# Altium schematic sheet Kalibracija3.SchDoc
size A4
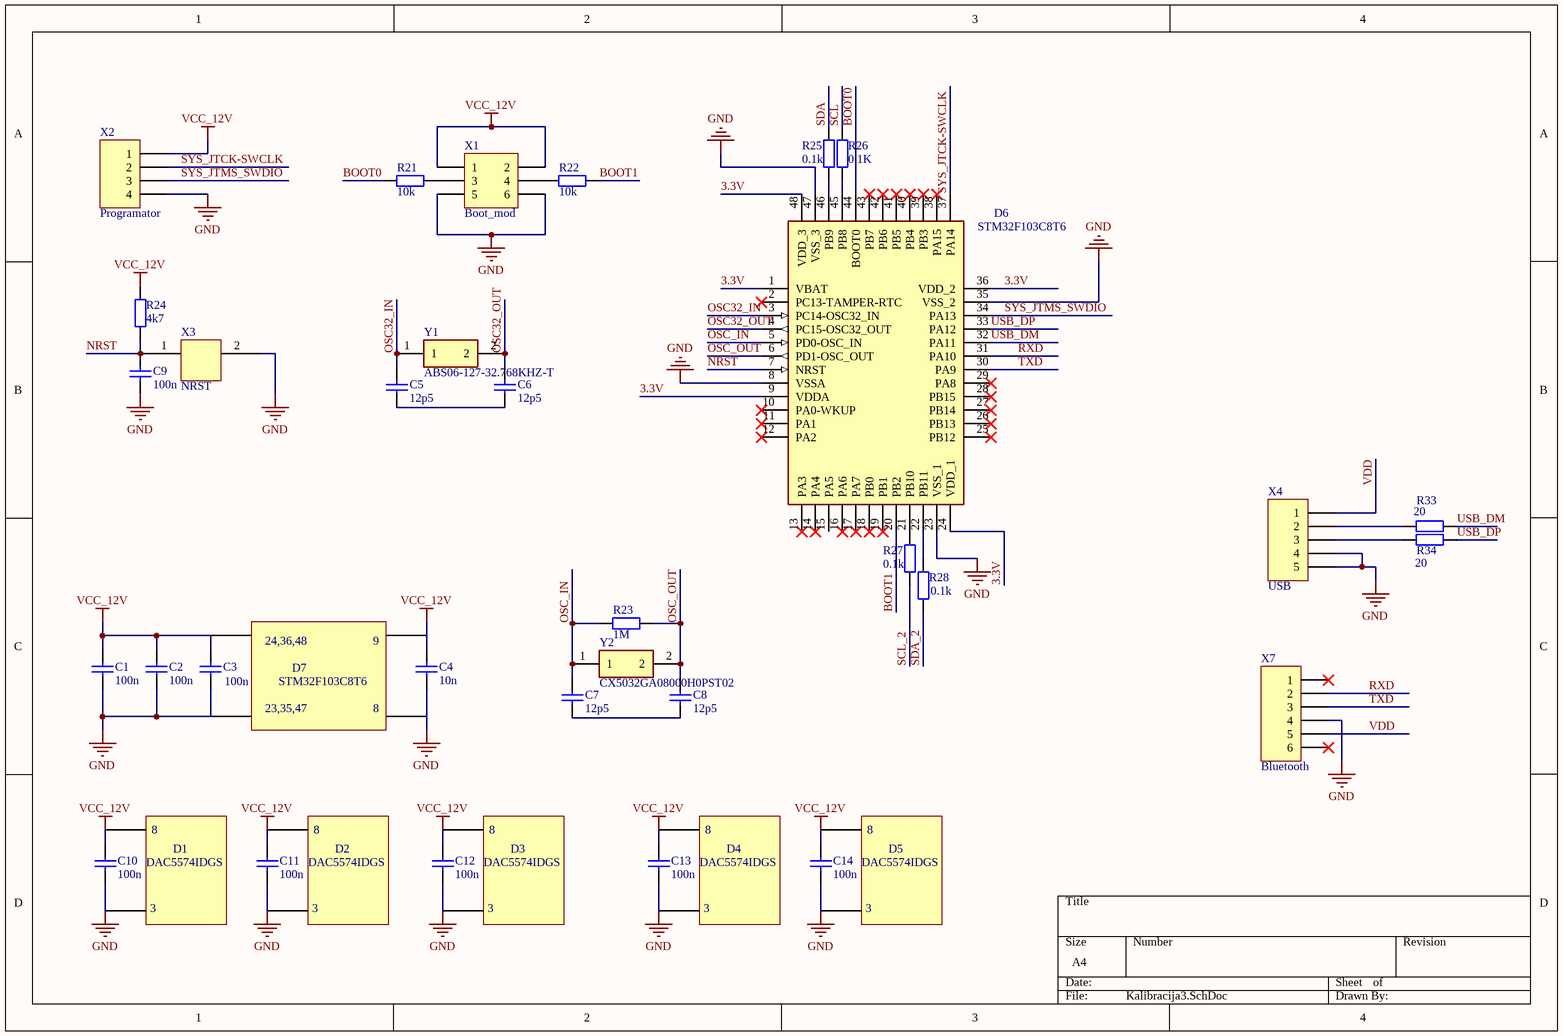
[diagram p0: Kalibracija3.SchDoc]

## Parts
C1  100n  [6-0805_N]
C2  100n  [6-0805_N]
C3  100n  [6-0805_N]
C4  10n  [6-0805_N]
C5  12p5  [6-0805_N]
C6  12p5  [6-0805_N]
C7  12p5  [6-0805_N]
C8  12p5  [6-0805_N]
C9  100n  [6-0805_N]
C10  100n  [6-0805_N]
C11  100n  [6-0805_N]
C12  100n  [6-0805_N]
C13  100n  [6-0805_N]
C14  100n  [6-0805_N]
D6  STM32F103C8T6  [QFP50P900X900X160-48N]
R21  10k  [6-0805_N]
R22  10k  [6-0805_N]
R23  1M  [6-0805_N]
R24  4k7  [6-0805_N]
R25  0.1k  [6-0805_N]
R26  0.1K  [6-0805_N]
R27  0.1k  [6-0805_N]
R28  value 0.1k  [AXIAL-0.4]  (hidden comment: Res2)
R33  20  [6-0805_N]
R34  20  [6-0805_N]
X1  Boot_mod  [HDR2X3]
X2  Programator  [HDR1X4]
X3  NRST  [HDR1X2]
X4  USB  [HDR1X5]
X7  Bluetooth  [HDR1X6]
Y1  ABS06-127-32.768KHZ-T  [ABS0612732768KHZT]
Y2  CX5032GA08000H0PST02  [CX5032GA08000H0PST02]

## Nets
GND: C1.1 C2.1 C3.1 C4.1 C9.1 C10.1 C11.1 C12.1 C13.1 C14.1 D6.8(VSSA) D6.23(VSS_1) D6.35(VSS_2) D6.47(VSS_3) X1.5 X1.6 X2.4 X3.2 X4.4 X4.5 X7.4
VCC_12V: C1.2 C2.2 C3.2 C4.2 C10.2 C11.2 C12.2 C13.2 C14.2 R24.1 X1.1 X1.2 X2.1
3.3V: D6.1(VBAT) D6.9(VDDA) D6.24(VDD_1) D6.36(VDD_2) D6.48(VDD_3)
BOOT0: D6.44(BOOT0) R21.2
BOOT1: D6.20(PB2) R22.1
NRST: C9.2 D6.7(NRST) R24.2 X3.1
OSC32_IN: C5.2 D6.3(PC14-OSC32_IN) Y1.1
OSC32_OUT: C6.2 D6.4(PC15-OSC32_OUT) Y1.2
OSC_IN: C7.2 D6.5(PD0-OSC_IN) R23.1 Y2.1
OSC_OUT: C8.2 D6.6(PD1-OSC_OUT) R23.2 Y2.2
RXD: D6.31(PA10) X7.2
SCL: R26.2
SCL_2: R27.1
SDA: R25.2
SDA_2: R28.1
SYS_JTCK-SWCLK: D6.37(PA14) X2.2
SYS_JTMS_SWDIO: D6.34(PA13) X2.3
TXD: D6.30(PA9) X7.3
USB_DM: D6.32(PA11) R33.2
USB_DP: D6.33(PA12) R34.2
VDD: X4.1 X7.5
NetC5_1: C5.1 C6.1
NetC7_1: C7.1 C8.1
NetD6_21: D6.21(PB10) R27.2
NetD6_22: D6.22(PB11) R28.2
NetD6_45: D6.45(PB8) R26.1
NetD6_46: D6.46(PB9) R25.1
NetR21_1: R21.1 X1.3
NetR22_2: R22.2 X1.4
NetR33_1: R33.1 X4.2
NetR34_1: R34.1 X4.3

Not connected (* = marked no-connect by the designer): D6 2(PC13-TAMPER-RTC)* 10(PA0-WKUP)* 11(PA1)* 12(PA2)* 13(PA3)* 14(PA4)* 15(PA5) 16(PA6)* 17(PA7)* 18(PB0)* 19(PB1)* 25(PB12)* 26(PB13)* 27(PB14)* 28(PB15)* 29(PA8)* 38(PA15)* 39(PB3)* 40(PB4)* 41(PB5)* 42(PB6)* 43(PB7)*; X7 1* 6*

## Notes on the sheet
- 24,36,48
- (near C4) 9
- 23,35,47
- STM32F103C8T6
- D7
- 8
- (near C10) 8
- D1
- (near C11) 8
- D2
- (near C12) 8
- D3
- (near C13) 8
- D4
- (near C14) 8
- D5
- DAC5574IDGS
- 3
- (near C11) DAC5574IDGS
- (near C12) DAC5574IDGS
- (near C14) DAC5574IDGS

## Library data of the parts
C1-C14 = Cap: Capacitor; Value: 100pF; Published: 8-Jun-2000; LatestRevisionDate: 17-Jul-2002; LatestRevisionNote: Re-released for DXP Platform.; PackageReference: RAD-0.3; Publisher: Altium Limited; PackageDescription: Radial Cap, Thru-Hole; 2 Leads; 0.3 in Pin Spacing
D6 = STM32F103C8T6: Integrated Circuit; Manufacturer_Name: STMicroelectronics; Allied_Number: 70390993; Datasheet Link: http://www.st.com/st-web-ui/static/active/en/resource/technical/document/datasheet/CD00161566.pdf; Height: 1.6mm; Manufacturer_Part_Number: STM32F103C8T6; Mouser Part Number: 511-STM32F103C8T6; Mouser Price/Stock: https://www.mouser.com/Search/Refine.aspx?Keyword=511-STM32F103C8T6; RS Part Number: 0402279P; RS Price/Stock: http://uk.rs-online.com/web/p/products/0402279P; Allied Price/Stock: http://www.alliedelec.com/stmicroelectronics-stm32f103c8t6/70390993/
R21-R27 R33 R34 = Res2: Resistor; Value: 1K; Published: 8-Jun-2000; LatestRevisionDate: 17-Jul-2002; LatestRevisionNote: Re-released for DXP Platform.; PackageReference: AXIAL-0.4; Publisher: Altium Limited; PackageDescription: Axial Device, Thru-Hole; 2 Leads; 0.4 in Pin Spacing
R28 = Res2: Resistor; Published: 8-Jun-2000; LatestRevisionDate: 17-Jul-2002; LatestRevisionNote: Re-released for DXP Platform.; PackageReference: AXIAL-0.4; Publisher: Altium Limited; PackageDescription: Axial Device, Thru-Hole; 2 Leads; 0.4 in Pin Spacing
X1 = Header 3X2: Header, 3-Pin, Dual row; LatestRevisionDate: 17-Jul-2002; LatestRevisionNote: Re-released for DXP Platform.; Publisher: Altium Limited
X2 = Header 4: Header, 4-Pin; LatestRevisionDate: 17-Jul-2002; LatestRevisionNote: Re-released for DXP Platform.; Publisher: Altium Limited
X3 = jumper
X4 = Header 5: Header, 5-Pin; LatestRevisionDate: 17-Jul-2002; LatestRevisionNote: Re-released for DXP Platform.; Publisher: Altium Limited
X7 = Header 6: Header, 6-Pin; LatestRevisionDate: 17-Jul-2002; LatestRevisionNote: Re-released for DXP Platform.; Publisher: Altium Limited
Y1 = ABS06-127-32.768KHZ-T: Crystal or Oscillator; Manufacturer_Name: ABRACON; Datasheet Link: https://abracon.com/datasheets/ABS06-127-32.768kHz-T.pdf; Height: 0.6mm; Manufacturer_Part_Number: ABS06-127-32.768KHZ-T; Mouser Part Number: 815-ABS0612732.768KT; Mouser Price/Stock: https://www.mouser.com/Search/Refine.aspx?Keyword=815-ABS0612732.768KT; RS Part Number: 1753472P; RS Price/Stock: http://uk.rs-online.com/web/p/products/1753472P
Y2 = CX5032GA08000H0PST02: Crystal or Oscillator; Manufacturer_Name: Kyocera Electronic Components; Datasheet Link: https://media.digikey.com/pdf/Data%20Sheets/AVX%20PDFs/CX5032GA08000H0PST02_Spec.pdf; Height: 1mm; Manufacturer_Part_Number: CX5032GA08000H0PST02; Mouser Part Number: 581-CX5032GA08H0PST; Mouser Price/Stock: https://www.mouser.com/Search/Refine.aspx?Keyword=581-CX5032GA08H0PST